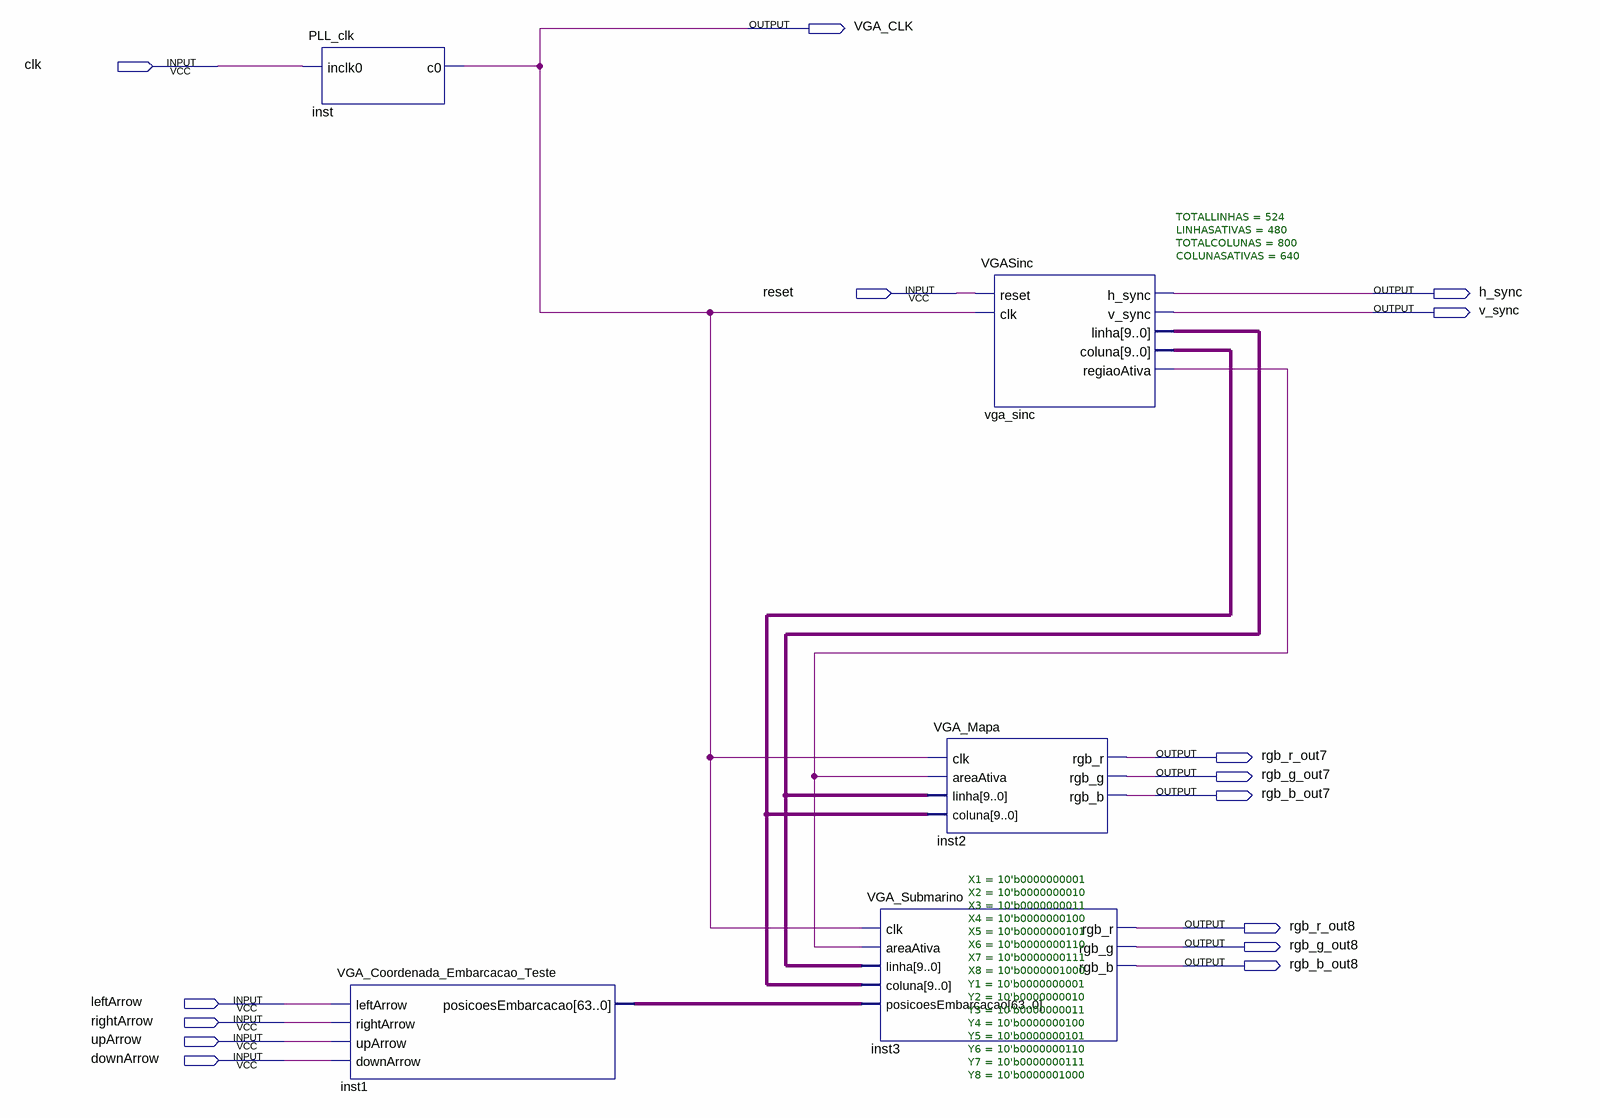
[diagram p0: schematic sheet]
// Quartus schematic VGA_TopLevel.bdf as structural Verilog: 5 symbols, 15 pins
module VGA_TopLevel (
  input  clk,
  input  reset,
  input  leftArrow,
  input  rightArrow,
  input  upArrow,
  input  downArrow,
  output VGA_CLK,
  output h_sync,
  output v_sync,
  output rgb_r_out7,
  output rgb_g_out7,
  output rgb_b_out7,
  output rgb_r_out8,
  output rgb_g_out8,
  output rgb_b_out8
);

  wire vga_sinc_regiaoativa;
  wire [9:0] vga_sinc_coluna, vga_sinc_linha;
  wire [63:0] inst1_posicoesembarcacao;

  PLL_clk inst (.inclk0(clk), .c0(VGA_CLK));
  VGA_Coordenada_Embarcacao_Teste inst1 (
    .leftArrow(leftArrow), .rightArrow(rightArrow), .upArrow(upArrow), .downArrow(downArrow),
    .posicoesEmbarcacao(inst1_posicoesembarcacao));
  VGA_Submarino #(.X1(10'b0000000001), .X2(10'b0000000010), .X3(10'b0000000011), .X4(10'b0000000100), .X5(10'b0000000101), .X6(10'b0000000110), .X7(10'b0000000111), .X8(10'b0000001000), .Y1(10'b0000000001), .Y2(10'b0000000010), .Y3(10'b0000000011), .Y4(10'b0000000100), .Y5(10'b0000000101), .Y6(10'b0000000110), .Y7(10'b0000000111), .Y8(10'b0000001000)) inst3 (
    .clk(VGA_CLK), .areaAtiva(vga_sinc_regiaoativa), .linha(vga_sinc_linha), .coluna(vga_sinc_coluna),
    .posicoesEmbarcacao(inst1_posicoesembarcacao), .rgb_r(rgb_r_out8), .rgb_g(rgb_g_out8), .rgb_b(rgb_b_out8));
  VGASinc #(.TOTALLINHAS(524), .LINHASATIVAS(480), .TOTALCOLUNAS(800), .COLUNASATIVAS(640)) vga_sinc (
    .reset(reset), .clk(VGA_CLK), .h_sync(h_sync), .v_sync(v_sync), .linha(vga_sinc_linha),
    .coluna(vga_sinc_coluna), .regiaoAtiva(vga_sinc_regiaoativa));
  VGA_Mapa inst2 (
    .clk(VGA_CLK), .areaAtiva(vga_sinc_regiaoativa), .linha(vga_sinc_linha), .coluna(vga_sinc_coluna),
    .rgb_r(rgb_r_out7), .rgb_g(rgb_g_out7), .rgb_b(rgb_b_out7));
endmodule
